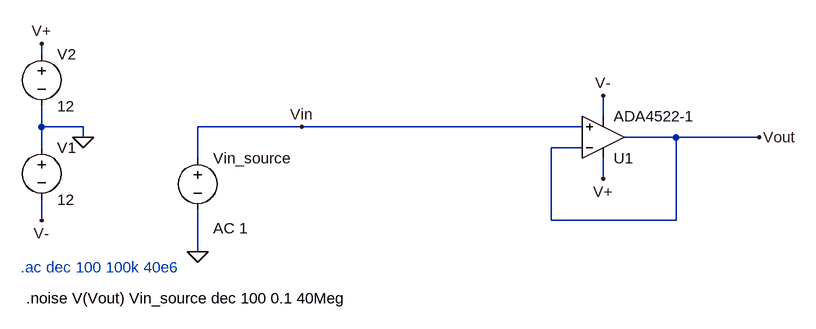
[diagram p0: schematic NonInvertUnityGain.asc]
NonInvertUnityGain.asc, the LTspice schematic file:
Version 4
SHEET 1 880 680
WIRE -336 0 -336 -16
WIRE 528 96 528 64
WIRE -336 112 -336 80
WIRE -272 112 -336 112
WIRE 64 112 -96 112
WIRE 496 112 64 112
WIRE -272 128 -272 112
WIRE 640 128 560 128
WIRE 768 128 640 128
WIRE -336 144 -336 112
WIRE 496 144 448 144
WIRE -96 160 -96 112
WIRE 528 192 528 160
WIRE -336 256 -336 224
WIRE 448 256 448 144
WIRE 640 256 640 128
WIRE 640 256 448 256
WIRE -96 304 -96 240
FLAG -272 128 0
FLAG -336 256 V-
FLAG -336 -16 V+
FLAG 528 192 V+
FLAG 528 64 V-
FLAG 768 128 Vout
FLAG 64 112 Vin
FLAG -96 304 0
SYMBOL Opamps\\ADA4522-1 528 192 M180
SYMATTR InstName U1
SYMBOL voltage -336 128 R0
WINDOW 123 0 0 Left 0
WINDOW 39 0 0 Left 0
SYMATTR InstName V1
SYMATTR Value 12
SYMBOL voltage -336 -16 R0
WINDOW 123 0 0 Left 0
WINDOW 39 0 0 Left 0
SYMATTR InstName V2
SYMATTR Value 12
SYMBOL voltage -96 144 R0
WINDOW 123 24 124 Left 2
WINDOW 39 0 0 Left 0
SYMATTR Value2 AC 1
SYMATTR InstName Vin_source
SYMATTR Value ""
TEXT -368 328 Left 2 ;.ac dec 100 100k 40e6
TEXT -360 376 Left 2 !.noise V(Vout) Vin_source dec 100 0.1 40Meg

The netlist it stands for:
* NonInvertUnityGain.asc
XU1 Vin Vout V+ V- Vout ADA4522-1  ; pins In+ In- V+ V- OUT
V1 0 V- 12
V2 V+ 0 12
Vin_source Vin 0 AC 1
* .ac dec 100 100k 40e6
.noise V(Vout) Vin_source dec 100 0.1 40Meg
.backanno
.end